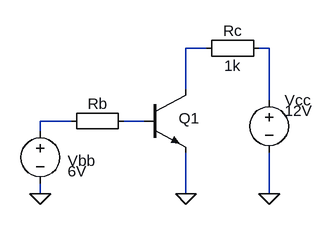
[diagram p0: schematic ce-switch-problem2.asc]
ce-switch-problem2.asc, the LTspice schematic file:
Version 4
SHEET 1 880 680
WIRE 240 16 208 16
WIRE 336 16 320 16
WIRE 208 80 208 16
WIRE 336 96 336 16
WIRE 32 128 -16 128
WIRE 144 128 112 128
WIRE -16 144 -16 128
WIRE -16 240 -16 224
WIRE 208 240 208 176
WIRE 336 240 336 176
FLAG 208 240 0
FLAG -16 240 0
FLAG 336 240 0
SYMBOL Misc\\EuropeanResistor 336 0 R90
WINDOW 0 5 56 VBottom 2
WINDOW 3 27 56 VTop 2
SYMATTR InstName Rc
SYMATTR Value 1k
SYMBOL Misc\\EuropeanResistor 128 112 R90
WINDOW 0 5 56 VBottom 2
WINDOW 3 27 56 VTop 2
SYMATTR InstName Rb
SYMATTR Value ""
SYMBOL voltage -16 128 R0
WINDOW 3 42 77 Left 2
WINDOW 123 0 0 Left 2
WINDOW 39 0 0 Left 2
WINDOW 0 42 61 Left 2
SYMATTR Value 6V
SYMATTR InstName Vbb
SYMBOL voltage 336 80 R0
WINDOW 3 24 32 Left 2
WINDOW 123 0 0 Left 2
WINDOW 39 0 0 Left 2
SYMATTR Value 12V
SYMATTR InstName Vcc
SYMBOL npn 144 80 R0
WINDOW 0 53 44 Left 2
SYMATTR InstName Q1
SYMATTR Value ""

The netlist it stands for:
* ce-switch-problem2.asc
Rc N002 N001 1k
Rb N004 N003
Vbb N003 0 6V
Vcc N002 0 12V
Q1 N001 N004 0 0
.model NPN NPN
.model PNP PNP
.lib standard.bjt
.backanno
.end